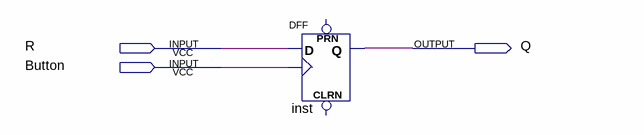
[diagram p0: schematic sheet]
// Quartus schematic lab4_3.bdf as structural Verilog: 1 symbols, 3 pins
module lab4_3 (
  input  R,
  input  Button,
  output Q
);

  DFF inst (.CLK(Button), .D(R), .Q(Q));  // open: CLRN, PRN
endmodule
